# Altium schematic sheet SINUX_V3_POWER.SchDoc
size 594 x 420 mm
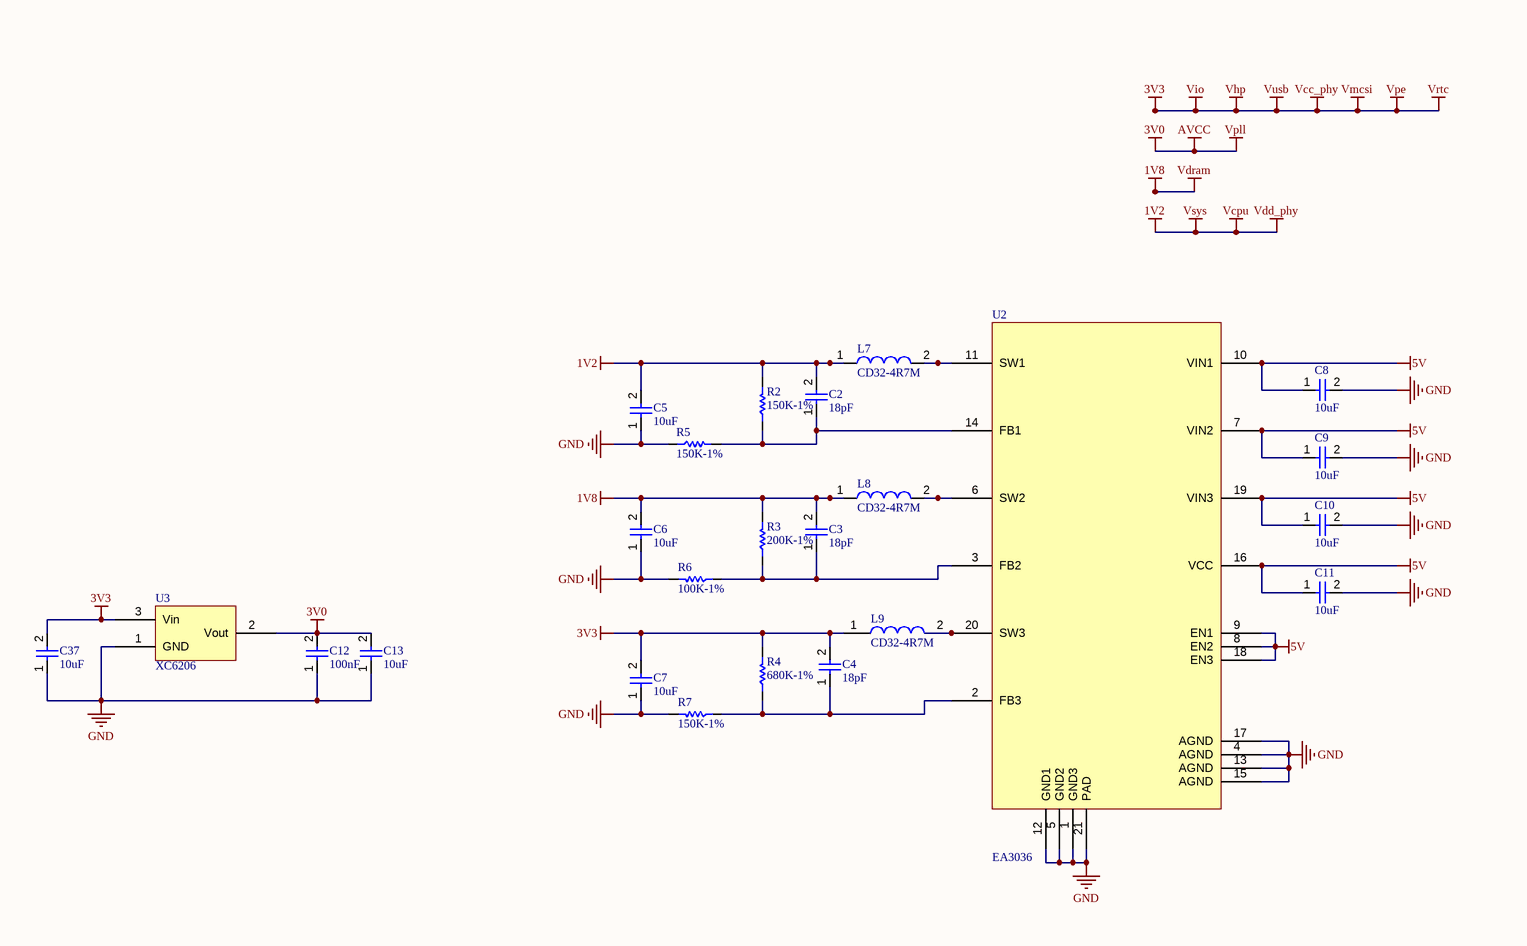
[diagram p0: SINUX_V3_POWER.SchDoc, left]
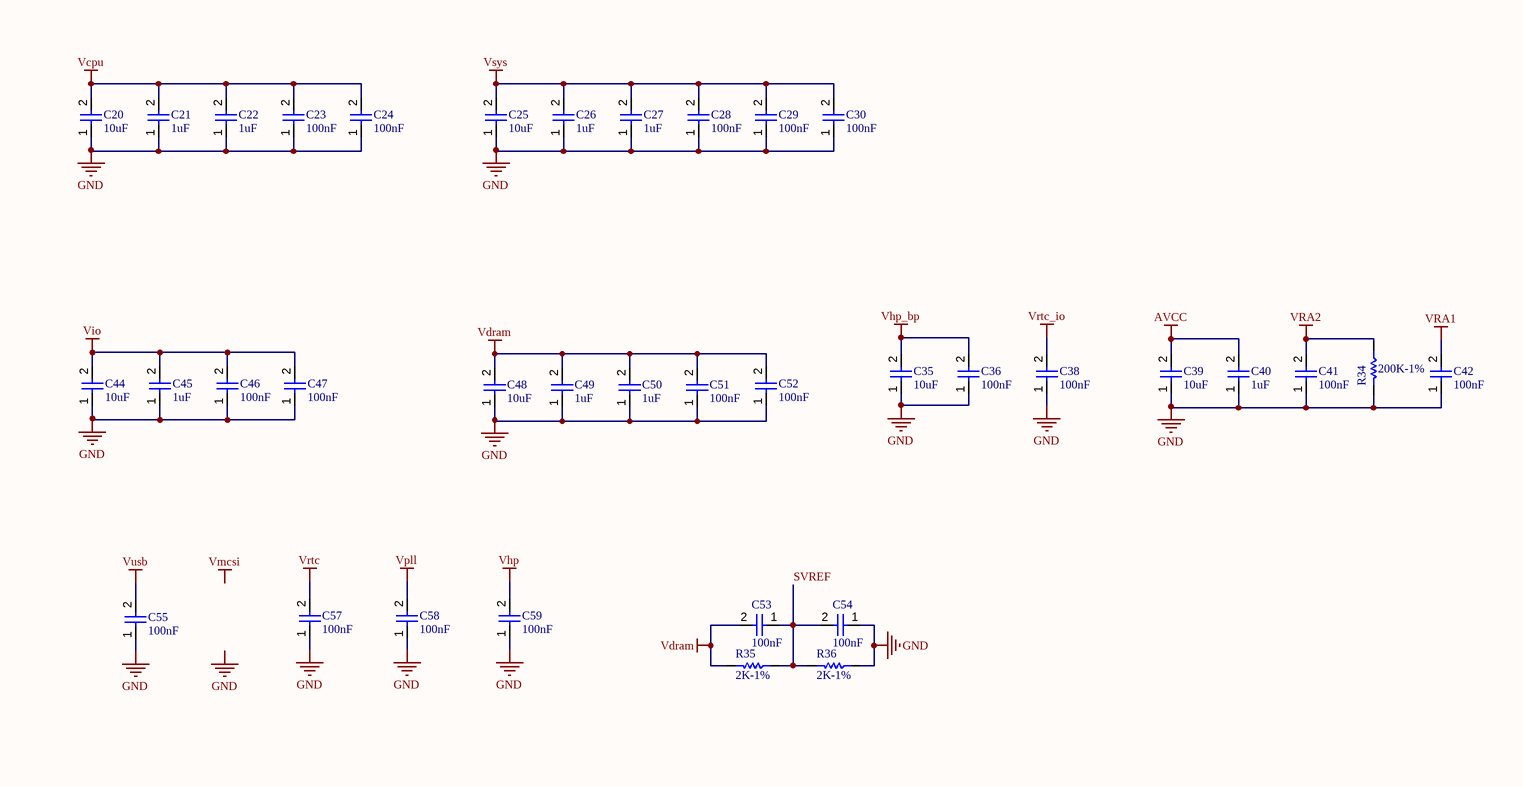
[diagram p1: SINUX_V3_POWER.SchDoc, right]

## Parts
C2  18pF  [SMD 0805]
C3  18pF  [SMD 0805]
C4  18pF  [SMD 0805]
C5  10uF  [SMD 0805]
C6  10uF  [SMD 0805]
C7  10uF  [SMD 0805]
C8  10uF  [SMD 0805]
C9  10uF  [SMD 0805]
C10  10uF  [SMD 0805]
C11  10uF  [SMD 0805]
C12  100nF  [SMD 0805]
C13  10uF  [SMD 0805]
C20  10uF  [SMD 0805]
C21  1uF  [SMD 0805]
C22  1uF  [SMD 0805]
C23  100nF  [SMD 0805]
C24  100nF  [SMD 0805]
C25  10uF  [SMD 0805]
C26  1uF  [SMD 0805]
C27  1uF  [SMD 0805]
C28  100nF  [SMD 0805]
C29  100nF  [SMD 0805]
C30  100nF  [SMD 0805]
C35  10uF  [SMD 0805]
C36  100nF  [SMD 0805]
C37  10uF  [SMD 0805]
C38  100nF  [SMD 0805]
C39  10uF  [SMD 0805]
C40  1uF  [SMD 0805]
C41  100nF  [SMD 0805]
C42  100nF  [SMD 0805]
C44  10uF  [SMD 0805]
C45  1uF  [SMD 0805]
C46  100nF  [SMD 0805]
C47  100nF  [SMD 0805]
C48  10uF  [SMD 0805]
C49  1uF  [SMD 0805]
C50  1uF  [SMD 0805]
C51  100nF  [SMD 0805]
C52  100nF  [SMD 0805]
C53  100nF  [SMD 0805]
C54  100nF  [SMD 0805]
C55  100nF  [SMD 0805]
C57  100nF  [SMD 0805]
C58  100nF  [SMD 0805]
C59  100nF  [SMD 0805]
L7  CD32-4R7M  [CD324R7M]
L8  CD32-4R7M  [CD324R7M]
L9  CD32-4R7M  [CD324R7M]
R2  150K-1%  [0805_1/8W]
R3  200K-1%  [0805_1/8W]
R4  680K-1%  [0805_1/8W]
R5  150K-1%  [0805_1/8W]
R6  100K-1%  [0805_1/8W]
R7  150K-1%  [0805_1/8W]
R34  200K-1%  [0805_1/8W]
R35  2K-1%  [0805_1/8W]
R36  2K-1%  [0805_1/8W]
U2  EA3036  [QFN40P300X300X80-21N]
U3  XC6206  [SOT95P280X130-3N]

## Nets
1V2: C2.2 C5.2 C20.2 C21.2 C22.2 C23.2 C24.2 C25.2 C26.2 C27.2 C28.2 C29.2 C30.2 L7.1 R2.2  [also labelled Vcpu, Vdd_phy, Vsys]
1V8: C3.2 C6.2 C48.2 C49.2 C50.2 C51.2 C52.2 C53.2 L8.1 R3.2 R35.2  [also labelled Vdram]
3V0: C12.2 C13.2 C39.2 C40.2 C58.2 U3.2(Vout)  [also labelled AVCC, Vpll]
3V3: C4.2 C7.2 C37.2 C44.2 C45.2 C46.2 C47.2 C55.2 C57.2 C59.2 L9.1 R4.2 U3.3(Vin)  [also labelled Vcc_phy, Vhp, Vio, Vmcsi, Vpe, Vrtc, Vusb]
5V: C8.1 C9.1 C10.1 C11.1 U2.7(VIN2) U2.8(EN2) U2.9(EN1) U2.10(VIN1) U2.16(VCC) U2.18(EN3) U2.19(VIN3)
GND: C5.1 C6.1 C7.1 C8.2 C9.2 C10.2 C11.2 C12.1 C13.1 C20.1 C21.1 C22.1 C23.1 C24.1 C25.1 C26.1 C27.1 C28.1 C29.1 C30.1 C35.1 C36.1 C37.1 C38.1 C39.1 C40.1 C41.1 C42.1 C44.1 C45.1 C46.1 C47.1 C48.1 C49.1 C50.1 C51.1 C52.1 C54.1 C55.1 C57.1 C58.1 C59.1 R5.1 R6.2 R7.2 R34.2 R36.1 U2.1(GND3) U2.4(AGND) U2.5(GND2) U2.12(GND1) U2.13(AGND) U2.15(AGND) U2.17(AGND) U2.21(PAD) U3.1(GND)
Vhp_bp: C35.2 C36.2
VRA1: C42.2
VRA2: C41.2 R34.1
Vrtc_io: C38.2
SVREF: C53.1 C54.2 R35.1 R36.2
NetC2_1: C2.1 R2.1 R5.2 U2.14(FB1)
NetC3_1: C3.1 R3.1 R6.1 U2.3(FB2)
NetC4_1: C4.1 R4.1 R7.1 U2.2(FB3)
NetL7_2: L7.2 U2.11(SW1)
NetL8_2: L8.2 U2.6(SW2)
NetL9_2: L9.2 U2.20(SW3)

## Notes on the sheet
- Labels drawn without touching a wire or pin: GND, Vmcsi
- DWG NO:
- REV:
- THIS DOCUMENT AND THE DATA DISCLOSED HEREIN OR
- HEREWITH IS THE PROPERTY OF ALTIUM LIMITED AND MAY
- BE FREELY DISTRIBUTED IN WHOLE. NO RIGHTS ARE
- RESERVED OR EXPRESS OR IMPLIED WARANTEE GIVEN.
- REVISION
- DESCRIPTION
- DATE
- APPROVED
- ENG:
- APPROVALS
- PROJECT
- DSN:
- CHK:
- REFERENCE DOCUMENTS
- PROJECT REVISION:
- TITLE
- DOCUMENT REVISION:
- DESIGN ITEM:
- BOM:
- FAB DWG:
- PCB DWG:
- ASSY DWG:
- SCALE:
- A2
- SIZE
- CAGE CODE
- FILE NAME
- DWG NO.
- SHEET
- OF
- REV

## Library data of the parts
C2-C13 C20-C30 C35-C42 C44-C55 C57-C59 = CAP NON
L7-L9 = CD32-4R7M: Inductor; Manufacturer_Name: Shuo Xing; Datasheet Link: http://aitendo3.sakura.ne.jp/aitendo_data/product_img/parts/coil/CD32/CD32.pdf; Height: 2.4mm; Manufacturer_Part_Number: CD32-4R7M
R2-R7 R34-R36 = RESISTOR